# Altium schematic sheet AudioCodec_Hardware.schdoc: Audio Codec Hardware Example
size B; Organization: Altium Limited; Address1: L3, 12a Rodborough Rd; Address2: Frenchs Forest; Address3: NSW; Address4: Australia 2086; DocumentNumber: 1; SheetNumber: 1; SheetTotal: 3
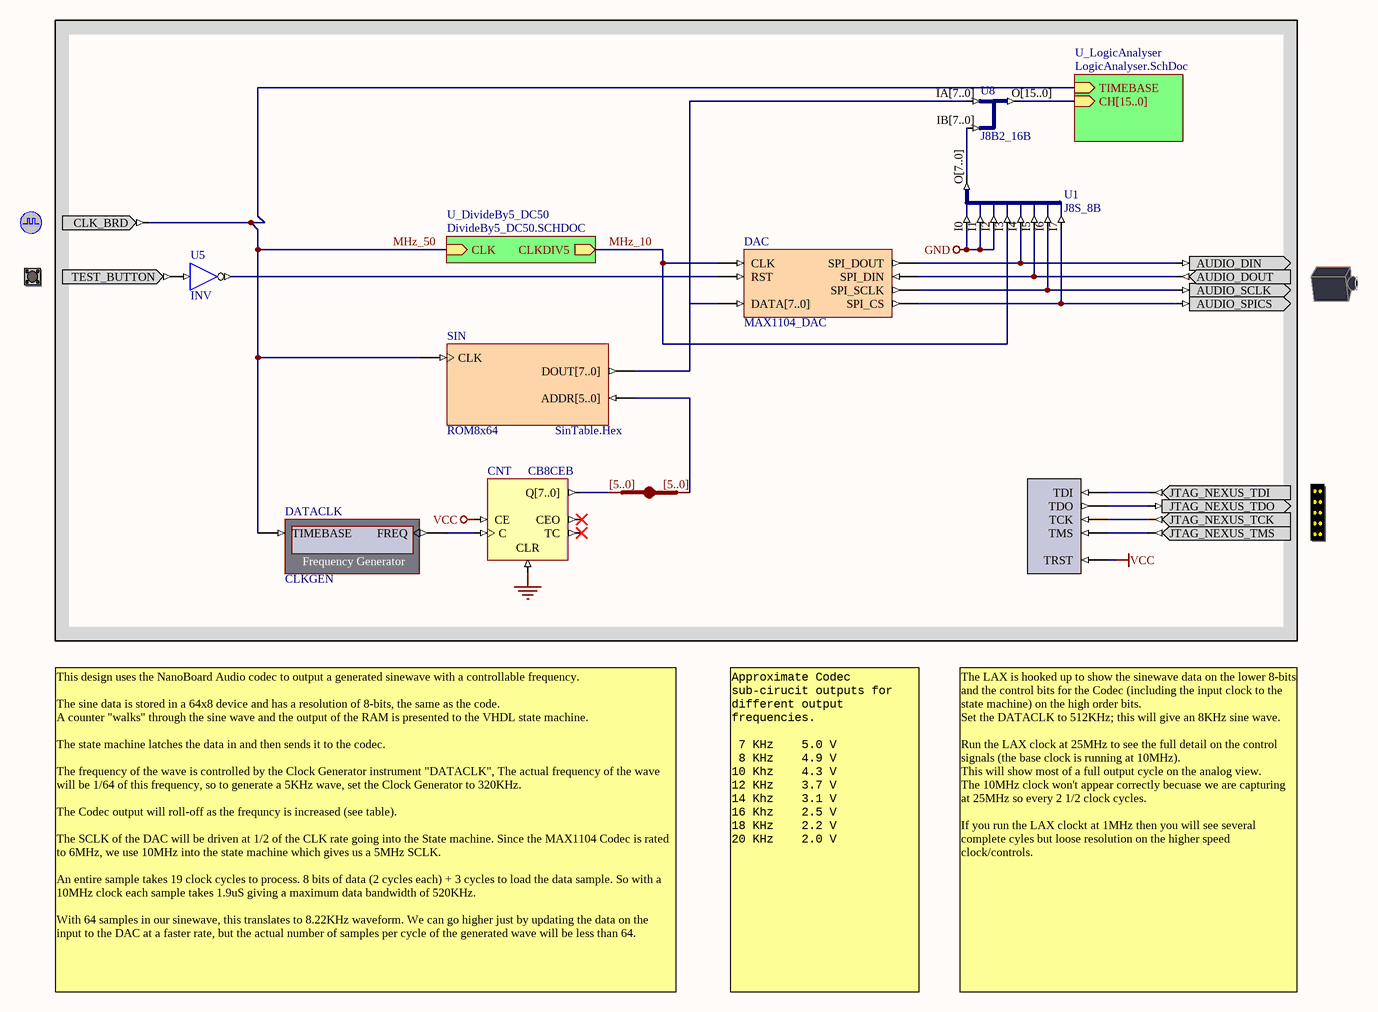
[diagram p0: AudioCodec_Hardware.schdoc]

## Parts
(Parts that share a designator on the sheet are numbered #1, #2 ... from top to bottom, then left to right.)
?#1  CLOCK_BOARD  (value not drawn)
?#2  TEST_BUTTON  (value not drawn)
?#3  AUDIO_DAC  (value not drawn)
?#4  NEXUS_JTAG_CONNECTOR  (value not drawn)
CNT  CB8CEB
DAC  MAX1104_DAC
DATACLK  CLKGEN
JB_AUTO1  IndexA: [5..0]  (hidden comment: JB)
NEXUS_JTAG_PORT  NEXUS_JTAG_PORT  (value not drawn)
SIN  ROM8x64  Memory_ContentFile: SinTable.Hex
U1  J8S_8B
U5  INV
U8  J8B2_16B

## Sub-sheets
U_DivideBy5_DC50 = DivideBy5_DC50.SCHDOC: CLKDIV5 (out), CLK (in)
U_LogicAnalyser = LogicAnalyser.SchDoc: CH[15..0] (in), TIMEBASE (in)

## Nets
GND: CNT.CLR U1.I0 U1.I1 U1.I2
VCC: CNT.CE NEXUS_JTAG_PORT.TRST
MHz_10: DAC.CLK U1.I3 ; sheet U_DivideBy5_DC50/CLKDIV5
MHz_50: ?#1.CLK_BRD DATACLK.TIMEBASE SIN.CLK ; sheet U_LogicAnalyser/TIMEBASE, sheet U_DivideBy5_DC50/CLK
Net?#2_TEST_BUTTON: ?#2.TEST_BUTTON U5.I
Net?#3_AUDIO_DIN: ?#3.AUDIO_DIN DAC.SPI_DOUT U1.I4
Net?#3_AUDIO_DOUT: ?#3.AUDIO_DOUT DAC.SPI_DIN U1.I5
Net?#3_AUDIO_SCLK: ?#3.AUDIO_SCLK DAC.SPI_SCLK U1.I6
Net?#3_AUDIO_SPICS: ?#3.AUDIO_SPICS DAC.SPI_CS U1.I7
Net?#4_JTAG_NEXUS_TCK: ?#4.JTAG_NEXUS_TCK NEXUS_JTAG_PORT.TCK
Net?#4_JTAG_NEXUS_TDI: ?#4.JTAG_NEXUS_TDI NEXUS_JTAG_PORT.TDI
Net?#4_JTAG_NEXUS_TDO: ?#4.JTAG_NEXUS_TDO NEXUS_JTAG_PORT.TDO
Net?#4_JTAG_NEXUS_TMS: ?#4.JTAG_NEXUS_TMS NEXUS_JTAG_PORT.TMS
NetCNT_C: CNT.C DATACLK.FREQ
NetCNT_Q[7..0]: CNT.Q[7..0] JB_AUTO1.A[0..0]
NetDAC_DATA[7..0]: DAC.DATA[7..0] SIN.DOUT[7..0] U8.IA[7..0]
NetDAC_RST: DAC.RST U5.O
NetJB_AUTO1_B[0..0]: JB_AUTO1.B[0..0] SIN.ADDR[5..0]
NetU1_O[7..0]: U1.O[7..0] U8.IB[7..0]
NetU8_O[15..0]: U8.O[15..0] ; sheet U_LogicAnalyser/CH[15..0]

Not connected (* = marked no-connect by the designer): CNT CEO* TC*

## Notes on the sheet
- This design uses the NanoBoard Audio codec to output a generated sinewave with a controllable frequency.
  The sine data is stored in a 64x8 device and has a resolution of 8-bits, the same as the code.
  A counter "walks" through the sine wave and the output of the RAM is presented to the VHDL state machine.
  The state machine latches the data in and then sends it to the codec.
  The frequency of the wave is controlled by the Clock Generator instrument "DATACLK", The actual frequency of the wave will be 1/64 of this frequency, so to generate a 5KHz wave, set the Clock Generator to 320KHz.
  The Codec output will roll-off as the frequncy is increased (see table).
  The SCLK of the DAC will be driven at 1/2 of the CLK rate going into the State machine. Since the MAX1104 Codec is rated to 6MHz, we use 10MHz into the state machine which gives us a 5MHz SCLK.
  An entire sample takes 19 clock cycles to process. 8 bits of data (2 cycles each) + 3 cycles to load the data sample. So with a 10MHz clock each sample takes 1.9uS giving a maximum data bandwidth of 520KHz.
  With 64 samples in our sinewave, this translates to 8.22KHz waveform. We can go higher just by updating the data on the input to the DAC at a faster rate, but the actual number of samples per cycle of the generated wave will be less than 64.
- Approximate Codec sub-cirucit outputs for different output frequencies.
  7 KHz    5.0 V
  8 KHz    4.9 V
  10 Khz    4.3 V
  12 KHz    3.7 V
  14 Khz    3.1 V
  16 Khz    2.5 V
  18 KHz    2.2 V
  20 KHz    2.0 V
- The LAX is hooked up to show the sinewave data on the lower 8-bits and the control bits for the Codec (including the input clock to the state machine) on the high order bits.
  Set the DATACLK to 512KHz; this will give an 8KHz sine wave.
  Run the LAX clock at 25MHz to see the full detail on the control signals (the base clock is running at 10MHz).
  This will show most of a full output cycle on the analog view.
  The 10MHz clock won't appear correctly becuase we are capturing at 25MHz so every 2 1/2 clock cycles.
  If you run the LAX clockt at 1MHz then you will see several complete cyles but loose resolution on the higher speed clock/controls.
- Title
- Size:
- Date:
- B
- Number:
- Time:
- Revision:
- Sheet
- of
- File:

## Library data of the parts
?#1 = CLOCK_BOARD: Global System Clock Supply; PortComponent: True; Published: 19-Nov-2003; Publisher: Altium Limited
?#2 = TEST_BUTTON: Test Button; PortComponent: True; Published: 19-Nov-2003; Publisher: Altium Limited
?#3 = AUDIO_DAC: Audio Jack; PortComponent: True; Published: 19-Nov-2003; Publisher: Altium Limited
?#4 = NEXUS_JTAG_CONNECTOR: JTAG Port; PortComponent: True; Published: 19-Nov-2003; Publisher: Altium Limited
CNT = CB8CEB: 8-Bit Cascadable Binary Counters with Clock Enable and Asynchronous Clear, Bus Version; Xilinx Equivalent: CB8CE; ArchiveName: GENERIC; Published: 18-Dec-2003; Publisher: Altium Limited; Core Revision: 1.00.00
DAC = MAX1104_DAC: MAX1104 DAC Controller; Published: 3/02/2004; Publisher: Altium Hobart Technology Centre; Core Revision: 1.00.00
DATACLK = CLKGEN: Frequency Generator; NEXUS_CORE: Instrument; NEXUS_JTAG_DEVICE: True; NEXUS_JTAG_ORDER: 0; Published: 18/12/2003; Publisher: Altium Hobart Technology Centre; Core Revision: 1.00.00
JB_AUTO1 = JB: System BUS Joiner; ArchiveName: GENERIC; Published: 18-Dec-2003; Publisher: Altium Limited; Core Revision: 1.00.00; IndexB: [5..0]
NEXUS_JTAG_PORT = NEXUS_JTAG_PORT: Nexus Processor JTAG Chain Connector; NEXUS_JTAG_CONNECTOR: True; Published: 5-Sep-2003; Publisher: Altium Hobart Technology Centre
SIN = ROM8x64: Single Port Read Only Memory 64 x 8; Memory_Depth: 64; Memory_Type: ROM_SinglePortBlock; Memory_Width: 8; Memory_ClockEdge: Rising; Nexus_Core: Memory_Program; Published: 26/09/2003; Publisher: Altium Hobart Technology Center
U1 = J8S_8B: 8 Single pin inputs to single 8-Bit output bus; ArchiveName: GENERIC; Published: 18-Dec-2003; Publisher: Altium Limited; Core Revision: 1.00.00
U5 = INV: Inverter; ArchiveName: GENERIC; Published: 18-Dec-2003; Publisher: Altium Limited; Xilinx Equivalent: INV; Core Revision: 1.00.00
U8 = J8B2_16B: 2 x 8-Bit input bus to 1 x 16-bit output bus; ArchiveName: GENERIC; Published: 18-Dec-2003; Publisher: Altium Limited; Core Revision: 1.00.00